# Altium schematic sheet SAM9X75 PWR.SchDoc
size A4; SheetNumber: 1; SheetTotal: 10
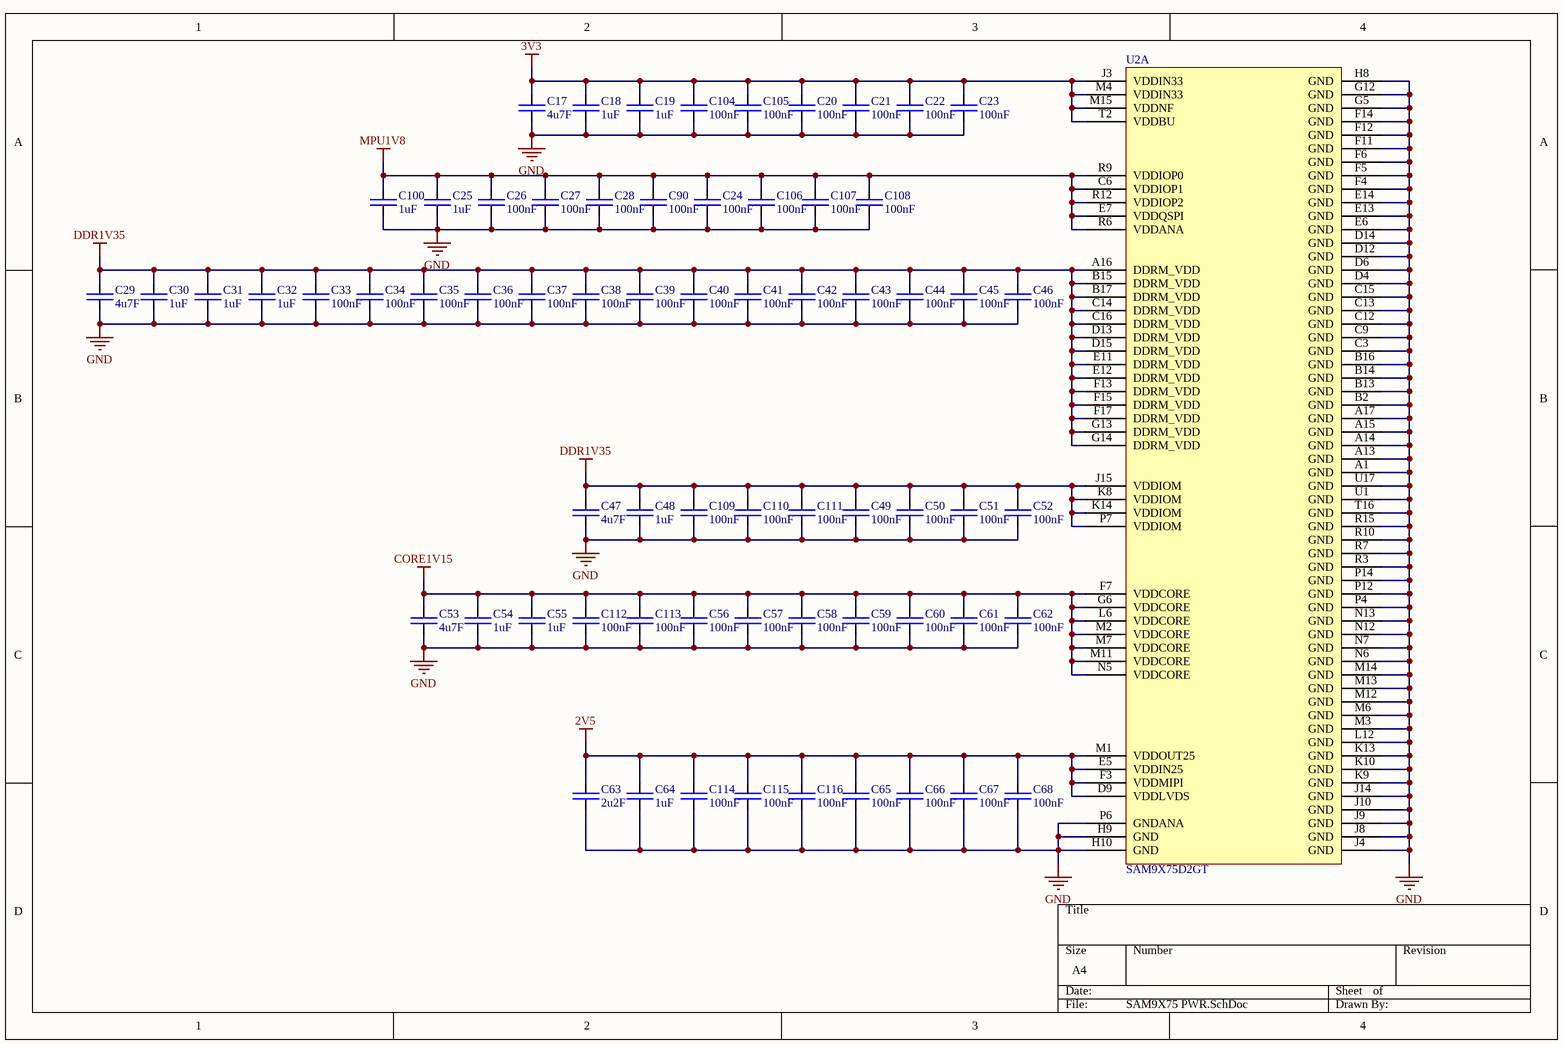
[diagram p0: SAM9X75 PWR.SchDoc]

## Parts
C17  4u7F  [CAP-0805]
C18  1uF  [CAP-0805]
C19  1uF  [CAP-0805]
C20  100nF  [CAP-0201]
C21  100nF  [CAP-0201]
C22  100nF  [CAP-0201]
C23  100nF  [CAP-0201]
C24  100nF  [CAP-0201]
C25  1uF  [CAP-0805]
C26  100nF  [CAP-0201]
C27  100nF  [CAP-0201]
C28  100nF  [CAP-0201]
C29  4u7F  [CAP-0805]
C30  1uF  [CAP-0805]
C31  1uF  [CAP-0805]
C32  1uF  [CAP-0805]
C33  100nF  [CAP-0201]
C34  100nF  [CAP-0201]
C35  100nF  [CAP-0201]
C36  100nF  [CAP-0201]
C37  100nF  [CAP-0201]
C38  100nF  [CAP-0201]
C39  100nF  [CAP-0201]
C40  100nF  [CAP-0201]
C41  100nF  [CAP-0201]
C42  100nF  [CAP-0201]
C43  100nF  [CAP-0201]
C44  100nF  [CAP-0201]
C45  100nF  [CAP-0201]
C46  100nF  [CAP-0201]
C47  4u7F  [CAP-0805]
C48  1uF  [CAP-0805]
C49  100nF  [CAP-0201]
C50  100nF  [CAP-0201]
C51  100nF  [CAP-0201]
C52  100nF  [CAP-0201]
C53  4u7F  [CAP-0805]
C54  1uF  [CAP-0805]
C55  1uF  [CAP-0805]
C56  100nF  [CAP-0201]
C57  100nF  [CAP-0201]
C58  100nF  [CAP-0201]
C59  100nF  [CAP-0201]
C60  100nF  [CAP-0201]
C61  100nF  [CAP-0201]
C62  100nF  [CAP-0201]
C63  2u2F  [CAP-0805]
C64  1uF  [CAP-0805]
C65  100nF  [CAP-0201]
C66  100nF  [CAP-0201]
C67  100nF  [CAP-0201]
C68  100nF  [CAP-0201]
C90  100nF  [CAP-0201]
C100  1uF  [CAP-0805]
C104  100nF  [CAP-0201]
C105  100nF  [CAP-0201]
C106  100nF  [CAP-0201]
C107  100nF  [CAP-0201]
C108  100nF  [CAP-0201]
C109  100nF  [CAP-0201]
C110  100nF  [CAP-0201]
C111  100nF  [CAP-0201]
C112  100nF  [CAP-0201]
C113  100nF  [CAP-0201]
C114  100nF  [CAP-0201]
C115  100nF  [CAP-0201]
C116  100nF  [CAP-0201]
U2  SAM9X75D2GT  [SAM9X75D]  (part A of 4)

## Nets
2V5: C63.2 C64.2 C65.2 C66.2 C67.2 C68.2 C114.2 C115.2 C116.2 U2.D9(VDDLVDS) U2.E5(VDDIN25) U2.F3(VDDMIPI) U2.M1(VDDOUT25)
3V3: C17.2 C18.2 C19.2 C20.2 C21.2 C22.2 C23.2 C104.2 C105.2 U2.J3(VDDIN33) U2.M4(VDDIN33) U2.M15(VDDNF) U2.T2(VDDBU)
CORE1V15: C53.2 C54.2 C55.2 C56.2 C57.2 C58.2 C59.2 C60.2 C61.2 C62.2 C112.2 C113.2 U2.F7(VDDCORE) U2.G6(VDDCORE) U2.L6(VDDCORE) U2.M2(VDDCORE) U2.M7(VDDCORE) U2.M11(VDDCORE) U2.N5(VDDCORE)
DDR1V35: C29.2 C30.2 C31.2 C32.2 C33.2 C34.2 C35.2 C36.2 C37.2 C38.2 C39.2 C40.2 C41.2 C42.2 C43.2 C44.2 C45.2 C46.2 C47.2 C48.2 C49.2 C50.2 C51.2 C52.2 C109.2 C110.2 C111.2 U2.A16(DDRM_VDD) U2.B15(DDRM_VDD) U2.B17(DDRM_VDD) U2.C14(DDRM_VDD) U2.C16(DDRM_VDD) U2.D13(DDRM_VDD) U2.D15(DDRM_VDD) U2.E11(DDRM_VDD) U2.E12(DDRM_VDD) U2.F13(DDRM_VDD) U2.F15(DDRM_VDD) U2.F17(DDRM_VDD) U2.G13(DDRM_VDD) U2.G14(DDRM_VDD) U2.J15(VDDIOM) U2.K8(VDDIOM) U2.K14(VDDIOM) U2.P7(VDDIOM)
GND: C17.1 C18.1 C19.1 C20.1 C21.1 C22.1 C23.1 C24.1 C25.1 C26.1 C27.1 C28.1 C29.1 C30.1 C31.1 C32.1 C33.1 C34.1 C35.1 C36.1 C37.1 C38.1 C39.1 C40.1 C41.1 C42.1 C43.1 C44.1 C45.1 C46.1 C47.1 C48.1 C49.1 C50.1 C51.1 C52.1 C53.1 C54.1 C55.1 C56.1 C57.1 C58.1 C59.1 C60.1 C61.1 C62.1 C63.1 C64.1 C65.1 C66.1 C67.1 C68.1 C90.1 C100.1 C104.1 C105.1 C106.1 C107.1 C108.1 C109.1 C110.1 C111.1 C112.1 C113.1 C114.1 C115.1 C116.1 U2.A1(GND) U2.A13(GND) U2.A14(GND) U2.A15(GND) U2.A17(GND) U2.B2(GND) U2.B13(GND) U2.B14(GND) U2.B16(GND) U2.C3(GND) U2.C9(GND) U2.C12(GND) U2.C13(GND) U2.C15(GND) U2.D4(GND) U2.D6(GND) U2.D12(GND) U2.D14(GND) U2.E6(GND) U2.E13(GND) U2.E14(GND) U2.F4(GND) U2.F5(GND) U2.F6(GND) U2.F11(GND) U2.F12(GND) U2.F14(GND) U2.G5(GND) U2.G12(GND) U2.H8(GND) U2.H9(GND) U2.H10(GND) U2.J4(GND) U2.J8(GND) U2.J9(GND) U2.J10(GND) U2.J14(GND) U2.K9(GND) U2.K10(GND) U2.K13(GND) U2.L12(GND) U2.M3(GND) U2.M6(GND) U2.M12(GND) U2.M13(GND) U2.M14(GND) U2.N6(GND) U2.N7(GND) U2.N12(GND) U2.N13(GND) U2.P4(GND) U2.P6(GNDANA) U2.P12(GND) U2.P14(GND) U2.R3(GND) U2.R7(GND) U2.R10(GND) U2.R15(GND) U2.T16(GND) U2.U1(GND) U2.U17(GND)
MPU1V8: C24.2 C25.2 C26.2 C27.2 C28.2 C90.2 C100.2 C106.2 C107.2 C108.2 U2.C6(VDDIOP1) U2.E7(VDDQSPI) U2.R6(VDDANA) U2.R9(VDDIOP0) U2.R12(VDDIOP2)

## Library data of the parts
C17-C19 C25 C29-C32 C47 C48 C53-C55 C63 C64 C100 = CAP-0805: Capacitor chip unpolarized. 0805
C20-C24 C26-C28 C33-C46 C49-C52 C56-C62 C65-C68 C90 C104-C116 = CAP-0201: Capacitor chip upolarized. 0201
U2 = SAM9X75D2GT: ARM9 SiP 2GBit Internal DDR3L